# Altium project Fast_Servo.PrjPCB (part 6 of 7)

## Sheet PWR_P12V0A_N12V0A.SchDoc: Power +12.0 V/-12.0 V
size 420 x 297 mm; Author: P. Zdunek; DrawnBy: P. Zdunek; DocumentNumber: 26; SheetNumber: 26; SheetTotal: 37; ModifiedBy: -; CheckedDate: -; Title2: Fast Stabilizer; DivGrp: WUT ISE; Designer: G.Kasprowicz
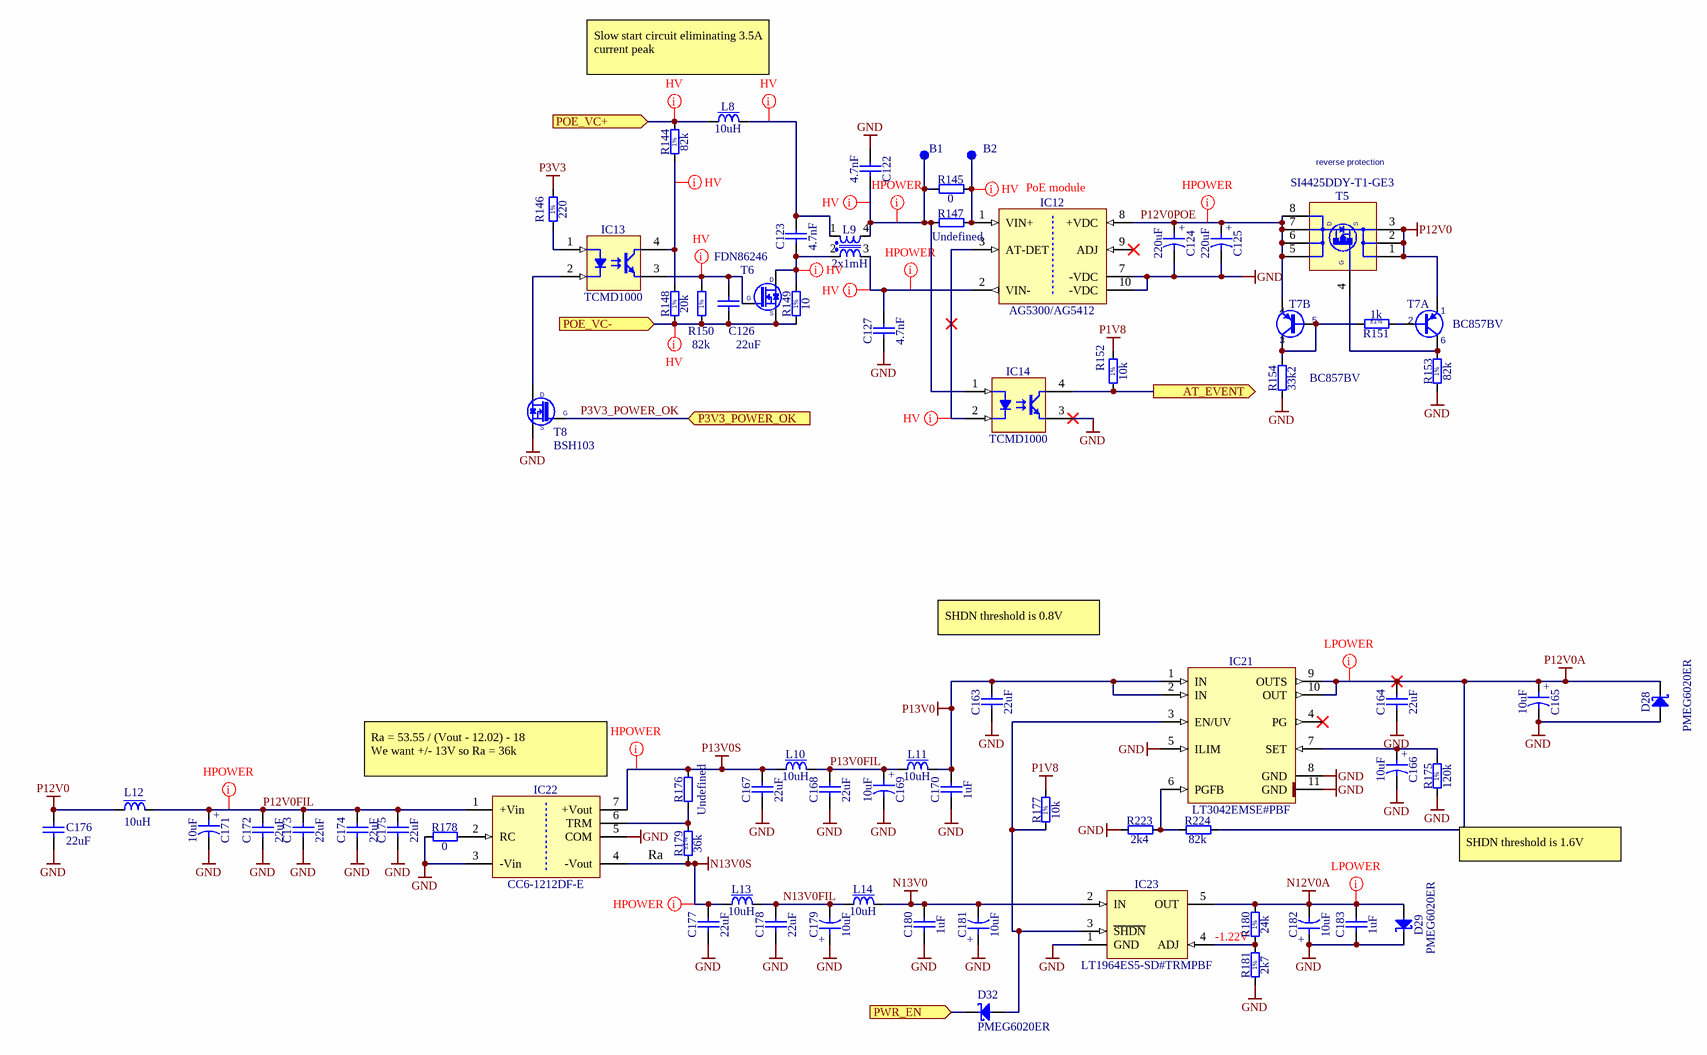
[diagram p21: PWR_P12V0A_N12V0A.SchDoc]

### Parts
B1  SMD Pad  [C100]  (value not drawn)  (no BOM)
B2  SMD Pad  [C100]  (value not drawn)  (no BOM)
C122  4.7nF  [CAPC3216X140N]
C123  4.7nF  [CAPC3216X140N]
C124  220uF  [CAPAE830X620N]
C125  220uF  [CAPAE830X620N]
C126  22uF  [CAPC2012X135N]
C127  4.7nF  [CAPC3216X140N]
C163  22uF  [CAPC2012X135N]
C164  22uF  [CAPC2012X135N]
C165  10uF  [CAPMP3216X180N]
C166  10uF  [CAPMP3216X180N]
C167  22uF  [CAPC2012X135N]
C168  22uF  [CAPC2012X135N]
C169  10uF  [CAPMP3216X180N]
C170  1uF  [CAPC1005X55N]
C171  10uF  [CAPMP3216X180N]
C172  22uF  [CAPC2012X135N]
C173  22uF  [CAPC2012X135N]
C174  22uF  [CAPC2012X135N]
C175  22uF  [CAPC2012X135N]
C176  22uF  [CAPC2012X135N]
C177  22uF  [CAPC2012X135N]
C178  22uF  [CAPC2012X135N]
C179  10uF  [CAPMP3216X180N]
C180  1uF  [CAPC1005X55N]
C181  10uF  [CAPMP3216X180N]
C182  10uF  [CAPMP3216X180N]
C183  1uF  [CAPC1005X55N]
D28  PMEG6020ER  [SODFL3517X110N]
D29  PMEG6020ER  [SODFL3517X110N]
D32  PMEG6020ER  [SODFL3517X110N]
IC12  AG5300/AG5412  [SILVERTEL_AG5300]
IC13  TCMD1000  [SOIC127P700X242-4N]
IC14  TCMD1000  [SOIC127P700X242-4N]
IC21  LT3042EMSE#PBF  [SOP50P490X110-11N-R168X198]
IC22  CC6-1212DF-E  [CC6-1212DF-E]
IC23  LT1964ES5-SD#TRMPBF  [SOT95P280X100-5N]
L8  10uH  [IND_MURATA-PS_8400]
L9  2x1mH  [IND_WURTH_WE-SL2]
L10  10uH  [IND_MURATA-PS_8400]
L11  10uH  [IND_MURATA-PS_8400]
L12  10uH  [IND_MURATA-PS_8400]
L13  10uH  [IND_MURATA-PS_8400]
L14  10uH  [IND_MURATA-PS_8400]
R144  82k  [RESC1608X55N]
R145  0  [RESC1005X40N]
R146  220  [RESC1608X55N]
R147  Undefined  [RESC1608X55N]
R148  20k  [RESC1005X40N]
R149  10  [RESC1005X40N]
R150  82k  [RESC1608X55N]
R151  1k  Tolerance: ±1%  [RESC1005X40N]
R152  10k  [RESC1005X40N]
R153  82k  [RESC1608X55N]
R154  33k2  [RESC1608X55N]
R175  120k  [RESC1608X55N]
R176  Undefined  [RESC1608X55N]
R177  10k  [RESC1005X40N]
R178  0  [RESC1005X40N]
R179  36k  Tolerance: ±1%  [RESC1005X40N]
R180  24k  [RESC1608X55N]
R181  2k7  [RESC1608X55N]
R223  2k4  [RESC1005X40N]
R224  82k  [RESC1608X55N]
T5  SI4425DDY-T1-GE3  [SOIC127P600X175-8N]
T6  FDN86246  [SOT95P237X112-3N]
T7  BC857BV  [SOTFL50P160X60-6N]  (parts A,B of 2)
T8  BSH103  [SOT95P230X110-3N]

### Ports
AT_EVENT (out), P3V3_POWER_OK (in), POE_VC+ (in), POE_VC- (in), PWR_EN (in)

### Nets
GND: C122.1 C124.2 C125.2 C127.1 C163.1 C164.1 C165.2 C166.2 C167.1 C168.1 C169.2 C170.1 C171.2 C172.1 C173.1 C174.1 C175.1 C176.1 C177.1 C178.1 C179.1 C180.1 C181.1 C182.1 C183.1 D28.2(A) D29.1(C) IC12.7(-VDC) IC12.10(-VDC) IC14.3(E) IC21.5(ILIM) IC21.8(GND) IC21.11(GND) IC22.3(-Vin) IC22.5(COM) IC23.1(GND) R153.1 R154.1 R175.1 R178.1 R181.1 R223.1 T8.2(S)
N12V0A: C182.2 C183.2 D29.2(A) IC23.5(OUT) R180.2
N13V0: C180.2 C181.2 IC23.2(IN) L14.2
N13V0S: C177.2 IC22.4(-Vout) L13.1 R179.1
P1V8: R152.2 R177.2
P3V3: R146.2
P12V0: C176.2 L12.1 T5.1(S) T5.2(S) T5.3(S) T7.1(E)
P12V0A: C164.2 C165.1 D28.1(C) IC21.9(OUTS) IC21.10(OUT) R224.2
P13V0: C163.2 C170.2 IC21.1(IN) IC21.2(IN) L11.2
P13V0S: C167.2 IC22.7(+Vout) L10.1 R176.2
AT_EVENT: IC14.4(C) R152.1 ; port AT_EVENT
N13V0FIL: C178.2 C179.2 L13.2 L14.1
P3V3_POWER_OK: T8.1(G) ; port P3V3_POWER_OK
P12V0FIL: C171.1 C172.2 C173.2 C174.2 C175.2 IC22.1(+Vin) L12.2
P12V0POE: C124.1 C125.1 IC12.8(+VDC) T5.5(D) T5.6(D) T5.7(D) T5.8(D) T7.4(E)
P13V0FIL: C168.2 C169.1 L10.2 L11.1
POE_VC+: L8.1 R144.2 ; port POE_VC+
POE_VC-: C126.1 R148.1 R149.1 R150.1 T6.2(S) ; port POE_VC-
PWR_EN: D32.1(C) ; port PWR_EN
NetB1_1: B1.1 C122.2 IC14.1(A) L9.4 R145.1 R147.1
NetB2_1: B2.1 IC12.1(VIN+) R145.2 R147.2
NetC123_1: C123.1 L9.2 R149.2 T6.3(D)
NetC123_2: C123.2 L8.2 L9.1
NetC126_2: C126.2 IC13.3(E) R150.2 T6.1(G)
NetC127_2: C127.2 IC12.2(VIN-) L9.3
NetC166_1: C166.1 IC21.7(SET) R175.2
NetD32_2: D32.2(A) IC21.3(EN/UV) IC23.3(~{SHDN}) R177.1
NetIC12_3: IC12.3(AT-DET) IC14.2(C)
NetIC13_1: IC13.1(A) R146.1
NetIC13_2: IC13.2(C) T8.3(D)
NetIC13_4: IC13.4(C) R144.1 R148.2
NetIC21_6: IC21.6(PGFB) R223.2 R224.1
NetIC22_2: IC22.2(RC) R178.2
NetIC22_6: IC22.6(TRM) R176.1 R179.2
NetIC23_4: IC23.4(ADJ) R180.1 R181.2
NetR151_1: R151.1 T7.2(B)
NetR151_2: R151.2 R154.2 T7.3(C) T7.5(B)
NetR153_2: R153.2 T5.4(S) T7.6(C)

Not connected (* = marked no-connect by the designer): IC12 9(ADJ)*; IC21 4(PG)*

### Layout directives
net class Hpower; rule Routing Via Style [Pref Size = 0.7mm    Pref Hole Size = 0.5mm]; rule Width Constraint [Pref Width = 20mil    Min Width = 15mil    Max Width = 50mil]: N13V0S, NetB1_1, NetC127_2, P12V0FIL, P12V0POE, P13V0S
net class Lpower: N12V0A, P12V0A
net class HV: NetB1_1, NetB2_1, NetC123_1, NetC123_2, NetC126_2, NetC127_2, NetIC12_3, NetIC13_4, POE_VC+, POE_VC-

### Notes on the sheet
- Slow start circuit eliminating 3.5A current peak
- (near IC12) PoE module
- (near T5) reverse protection
- SHDN threshold is 0.8V
- Ra = 53.55 / (Vout - 12.02) - 18
  We want +/- 13V so Ra = 36k
- (near R179) Ra
- (near R175) SHDN threshold is 1.6V
- -1.22V
- Project/Equipment
- Document
- Designer
- Drawn by
- Check.by
- Copyright WUT ISE 2020.
  This documentation describes Open Hardware and is licensed under the CERN OHL v.1.2. You may redistribute and modify this documentation under the terms of the CERN OHL v.1.2. (http://ohwr.org/CERNOHL). This documentation is distributed WITHOUT ANY EXPRESS OR IMPLIED WARRANTY, INCLUDING OF MERCHANTABILITY, SATISFACTORY QUALITY AND FITNESS FOR A PARTICULAR PURPOSE. Please see the CERN OHL v.1.2 for applicable conditions.
- Contact
- File
- Last Mod.
- Print Date
- Sheet
- Size
- A3
- of
- Rev
- (in symbol CAE830-620_220UF_16V_20%) +
- (in symbol CTE3216-18_10UF_16V_20%_AVX_TCJ) +
- (in symbol R0402_10K_1%_0.0625W_100PPM) 1%
- (in symbol R0402_10R_1%_0.0625W_200PPM) 1%
- (in symbol R0402_20K_1%_0.0625W_100PPM) 1%
- (in symbol R0603_2K7_1%_0.1W_100PPM) 1%
- (in symbol R0603_24K_1%_0.1W_100PPM) 1%
- (in symbol R0603_82K_1%_0.1W_100PPM) 1%
- (in symbol R0603_120k_1%_0.1W_100PPM) 1%
- (in symbol R0603_220R_1%_0.1W_100PPM) 1%
- (in symbol SI4425DDY-T1-GE3) G

### Library data of the parts
B1 B2 = SMD_PAD_D1MM: Through Hole Pad; Part Description: 1mm Diameter SMD Pad; Mounted: No; Part Number: SMD_PAD_D1MM; Component Type: Standard (No BOM); Pin Count: 1; Family: SMD Pad; Socket: No; SMD: No; Sense: No; Status: None; ComponentHeight: 0mm; HelpURL: Undefined; Author: CERN DEM JLC; CreateDate: 10.10.2017; LatestRevisionDate: 10.10.2017; PackageDescription: 1mm Diameter SMD Pad
C122 C123 C127 = CAP_SMD_1206_4.7n_500V: Non-polarised capacitor; Part Number: CC1206_4.7NF_500V_10%_X7R; Part Description: SMD Multilayer Chip Ceramic Capacitor; Manufacturer: GENERIC; Manufacturer1 Part Number: C1206C472KCRACTU; Voltage: 500V; TC: X7R; Tolerance: ±10%; Table: Capacitors SMD; Component Kind: Standard; Component Type: Standard; Pin Count: 2; Value: 4.7nF; Status: Preferred; Manufacturer Part Number: CC1206_4.7NF_500V_10%_X7R; Case: 1206; Mounted: Yes; Socket: No; SMD: Yes; Manufacturer1 Example: KEMET; Manufacturer1 ComponentHeight: 1.7mm; HelpURL: \\cern.ch\dfs\Applications\Altium\Datasheets\CC1206_X7R_VISHAY_VJ.pdf; Author: GK; CreateDate: 2007-12-03; LatestRevisionDate: 2007-12-03
C124 C125 = CAE830-620_220UF_16V_20%: Polarised capacitor; Part Description: Aluminum Electrolytic SMT Capacitor; Manufacturer: PANASONIC; Manufacturer Part Number: EEEFK1C221AP; Voltage: 16V; Tolerance: ±20%; Part Number: CAE830-620_220UF_16V_20%; Component Kind: Standard; Component Type: Standard; Pin Count: 2; Value: 220uF; Status: Not Recommended; Case: E; Mounted: Yes; Socket: No; SMD: Yes; Sense: No; ComponentHeight: 6.2mm; HelpURL: \\cern.ch\dfs\Applications\Altium\Datasheets\CAE_PANASONIC_FK.pdf; Author: CERN DEM JLC; CreateDate: 03.12.2007; LatestRevisionDate: 05.11.2014
C126 C163 C164 C167 C168 C172-C178 = CC0805_22UF_16V_10%_X5R: Non-polarised capacitor; Part Description: SMD Multilayer Chip Ceramic Capacitor; Manufacturer: GENERIC; Manufacturer1 Part Number: C2012X5R1C226KT; Voltage: 16V; TC: X5R; Tolerance: ±10%; Part Number: CC0805_22UF_16V_10%_X5R; Component Kind: Standard; Component Type: Standard; Pin Count: 2; Value: 22uF; Status: Preferred; Manufacturer Part Number: CC0805_22UF_16V_10%_X5R; Case: 0805; Mounted: Yes; Socket: No; SMD: Yes; Sense: No; Manufacturer1 Example: TDK; Manufacturer1 ComponentHeight: 1.35mm; HelpURL: \\cern.ch\dfs\Applications\Altium\Datasheets\CC0805_X5R_TDK_C.pdf; Author: CERN DEM JLC; CreateDate: 25.10.2012; LatestRevisionDate: 25.10.2012
C165 C166 C169 C171 C179 C181 C182 = CTE3216-18_10UF_16V_20%_AVX_TCJ: Polarised capacitor; Part Description: ESR 0R200 Tantalum Solid Electrolytic Chip Capacitor with Conductive Polymer Electrode; Manufacturer: AVX; Manufacturer Part Number: TCJA106M016R0200; Voltage: 16V; Tolerance: ±20%; Part Number: CTE3216-18_10UF_16V_20%_AVX_TCJ; Component Kind: Standard; Component Type: Standard; Pin Count: 2; Value: 10uF; Status: Preferred; Case: A; Mounted: Yes; Socket: No; SMD: Yes; Sense: No; ComponentHeight: 1.8mm; HelpURL: \\cern.ch\dfs\Applications\Altium\Datasheets\CTE_AVX_TCJ.pdf; Author: CERN DEM JLC; CreateDate: 29.03.2012; LatestRevisionDate: 29.03.2012
C170 C180 C183 = CC0402_1UF_16V_10%_X5R: Non-polarised capacitor; Part Description: SMD Multilayer Chip Ceramic Capacitor; Manufacturer: GENERIC; Manufacturer1 Part Number: C1005X5R1C105KT; Voltage: 16V; TC: X5R; Tolerance: ±10%; Part Number: CC0402_1UF_16V_10%_X5R; Component Kind: Standard; Component Type: Standard; Pin Count: 2; Value: 1uF; Status: Preferred; Manufacturer Part Number: CC0402_1UF_16V_10%_X5R; Case: 0402; Mounted: Yes; Socket: No; SMD: Yes; Sense: No; Manufacturer1 Example: TDK; Manufacturer1 ComponentHeight: 0.55mm; HelpURL: \\cern.ch\dfs\Applications\Altium\Datasheets\CC0402_X5R_TDK_C.pdf; Author: CERN DEM JLC; CreateDate: 25/10/2012; LatestRevisionDate: 25/10/2012
D28 D29 D32 = PMEG6020ER: Schottky Diode; Part Description: MEGA Schottky Barrier Rectifier; Manufacturer: NXP SEMICONDUCTORS; Voltage: 60V; Power: 2A; PressFit: No; Bonding: No; Part Number: PMEG6020ER; Component Kind: Standard; Component Type: Standard; Device: PMEG6020ER; PackageDescription: SODFL Diode (SOD123W); 2.60mm W X 1.70mm L X 1.10mm H body, IPC Medium Density; Manufacturer Part Number: PMEG6020ER; Pin Count: 2; Case: SOD-123FL; Mounted: Yes; Socket: No; SMD: Yes; Sense: No; ComponentHeight: 1.1mm; HelpURL: \\cern.ch\dfs\Applications\Altium\Datasheets\PMEG6020ER.pdf; Author: CERN DEM JMW; CreateDate: 19.06.2014; LatestRevisionDate: 19.06.2014
IC12 = AG5300: Power-over-Ethernet Plus (POE+) Module; Part Description: 12V 30W Power-over-Ethernet Plus (POE+); Manufacturer: SILVERTEL; PressFit: No; Bonding: No; Part Number: AG5300/AG5412; Component Kind: Standard; Component Type: Standard; Device: AG5300/AG5412; PackageDescription: Power-over-Ethernet Plus (POE+) Module, Body L 57.3mm x W 18mm x H 14mm; Manufacturer Part Number: AG5300/AG5412; Pin Count: 10; Mounted: Yes; Socket: No; SMD: No; Sense: No; ComponentHeight: 14mm; HelpURL: \\cern.ch\dfs\Applications\Altium\Datasheets\AG5300.pdf; Author: CERN DEM JLC; CreateDate: 20.03.2018; LatestRevisionDate: 20.03.2018
IC13 IC14 = TCMD1000: Single Optocoupler; Part Number: TCMD1000-217-500E; Part Description: DC Input, Half-Pitch Phototransistor Optocoupler; Manufacturer: VISHAY; PressFit: No; Bonding: No; Component Kind: Standard; Component Type: Standard; Device: TCMD1000; PackageDescription: SOIC, 1.27mm, pitch; 4 pin, 2.60mm W X 4.40mm L X 2.42mm H body, IPC Medium Density; Status: Not Recommended; Manufacturer Part Number: TCMD1000; Pin Count: 4; Case: SOIC4; Mounted: Yes; Socket: No; SMD: Yes; Sense: No; ComponentHeight: 2.42mm; HelpURL: \\cern.ch\dfs\Applications\Altium\Datasheets\ACPL-217-500E.pdf; Author: GK; CreateDate: 11.11.2014; LatestRevisionDate: 11.11.2014
IC21 = LT3042EMSE#PBF: 20V, 200mA, Ultralow Noise, Ultrahigh PSRR RF Linear Regulator; Manufacturer: LINEAR TECHNOLOGY; PressFit: No; Bonding: No; Part Number: LT3042EMSE#PBF; Component Kind: Standard; Component Type: Standard; Device: LT3042EMSE#PBF; PackageDescription: SOP, 0.50mm, Pitch; 10 pin, 3.00mm W X 3.00mm L X 1.10mm H body (w/thermal tab  1.68 X 1.98 mm), IPC Medium Density; Part Description: 20V, 200mA, Ultralow Noise, Ultrahigh PSRR RF Linear Regulator; Manufacturer Part Number: LT3042EMSE#PBF; Pin Count: 11; Case: MSOP10; Mounted: Yes; Socket: No; SMD: Yes; Sense: No; ComponentHeight: 1.1mm; HelpURL: \\cern.ch\dfs\Applications\Altium\Datasheets\LT3042EMSE#PBF.pdf; Author: CERN DEM MR; CreateDate: 09.06.2016; LatestRevisionDate: 09.06.2016
IC22 = DC/DC_CC6-1212DF-E: CONV DC/DC 6W DUAL 12V +-12V PCB; Manufacturer: TDK-Lambda Americas Inc.; PressFit: No; Bonding: No; Part Number: CC6-1212DF-E; Component Kind: Standard; Component Type: Standard; Device: CC6-1212DF-E; PackageDescription: CC6 Series, Body 0.900 x 0.831 x 0.335, Regulated; Part Description: CONV DC/DC 6W DUAL 12V +-12V PCB; Manufacturer Part Number: CC6-1212DF-E; Pin Count: 7; Mounted: Yes; Socket: No; SMD: No; Sense: No; ComponentHeight: 10.45mm; Author: GK; CreateDate: 17.12.2016; LatestRevisionDate: 17.12.2016
IC23 = LT1964ES5-SD#TRMPBF: 200mA, Low Noise, Low Dropout Negative Micropower Regulator; Part Description: -1.22V to -20V, 200mA, Low Noise, Low Dropout Negative Micropower Regulator; Manufacturer: LINEAR TECHNOLOGY; PressFit: No; Bonding: No; Part Number: LT1964ES5-SD#TRMPBF; Component Kind: Standard; Component Type: Standard; Device: LT1964ES5-SD#TRMPBF; PackageDescription: SOT23, 0.95mm pitch; 5 pin, 1.75mm W X 3.00mm L, IPC Medium Density; Manufacturer Part Number: LT1964ES5-SD#TRMPBF; Pin Count: 5; Case: SOT23-5; Mounted: Yes; Socket: No; SMD: Yes; Sense: No; ComponentHeight: 1mm; HelpURL: \\cern.ch\dfs\Applications\Altium\Datasheets\LT1964ES5-SD#TRMPBF.pdf; Author: CERN DEM JLC; CreateDate: 05.05.2009; LatestRevisionDate: 05.05.2009
L8 L10-L14 = IND_10UH_10%_MURATA-PS_8400: Inductor With Core; Part Description: Miniature Surface Mount Power Inductor (8400 Serie); Manufacturer: MURATA POWER SOLUTIONS; Manufacturer Part Number: 84103C; Power: 950mA; Resistance: 0.24R; Tolerance: ±10%; Part Number: IND_10UH_10%_MURATA-PS_8400; Component Kind: Standard; Component Type: Standard; Pin Count: 2; Value: 10uH; Status: None; Mounted: Yes; Socket: No; SMD: Yes; Sense: No; ComponentHeight: 2.9mm; HelpURL: \\cern.ch\dfs\Applications\Altium\Datasheets\IND_MURATA-PS_8400.pdf; Author: CERN DEM JLC; CreateDate: 02.07.2012; LatestRevisionDate: 02.07.2012
L9 = IND_1MH_50%_WURTH_WE-SL2-744222: Inductor Common Mode; Part Description: Common Mode SMD Line Filter (WE-SL2 Series); Manufacturer: WURTH ELEKTRONIK; Manufacturer Part Number: 744222; Power: 800mA; Resistance: 0.31R; Tolerance: ±50%; Part Number: IND_1MH_50%_WURTH_WE-SL2-744222; Component Kind: Standard; Component Type: Standard; Pin Count: 4; Value: 2x1mH; Status: None; Mounted: Yes; Socket: No; SMD: Yes; Sense: No; ComponentHeight: 5.3mm; HelpURL: \\cern.ch\dfs\Applications\Altium\Datasheets\IND_WURTH_WE-SL2_744222.pdf; Author: CERN DEM JLC; CreateDate: 04.06.2012; LatestRevisionDate: 15.10.2012
R144 R150 R153 = R0603_82K_1%_0.1W_100PPM: Resistor - 1%; Part Description: General Purpose Thick Film Chip Resistor; Manufacturer: GENERIC; Manufacturer1 Part Number: NRC06F8202TRF; Power: 0.1W; TC: ±100ppm/°C; Part Number: R0603_82K_1%_0.1W_100PPM; Component Kind: Standard; Component Type: Standard; Pin Count: 2; Value: 82k; Status: Preferred; Tolerance: ±1%; Manufacturer Part Number: R0603_82K_1%_0.1W_100PPM; Case: 0603; Mounted: Yes; Sense: No; Socket: No; SMD: Yes; Manufacturer1 Example: NIC COMPONENT; Manufacturer1 ComponentHeight: 0.55mm; HelpURL: \\cern.ch\dfs\Applications\Altium\Datasheets\R0603_NIC_NRC.pdf; Author: CERN DEM JLC; CreateDate: 03.12.2007; LatestRevisionDate: 13.03.2008
R145 R178 = R0402_0R_JUMPER: Resistor; Part Description: 1A (0.05R Max DC Resistance) Zero Ohm Jumper; Manufacturer: GENERIC; Manufacturer1 Part Number: 232270591001L; Part Number: R0402_0R_JUMPER; Component Kind: Standard; Component Type: Standard; Pin Count: 2; Value: 0; Status: Not recommended; Manufacturer Part Number: R0402_0R_JUMPER; Case: 0402; Mounted: Yes; Sense: No; Socket: No; SMD: Yes; Manufacturer1 Example: YAGEO PHYCOMP; Manufacturer1 ComponentHeight: 0.4mm; HelpURL: \\cern.ch\dfs\Applications\Altium\Datasheets\R0402_Phycomp_RC0402.pdf; Author: CERN DEM JLC; CreateDate: 03.12.2007; LatestRevisionDate: 17.10.2012
R146 = R0603_220R_1%_0.1W_100PPM: Resistor - 1%; Part Description: General Purpose Thick Film Chip Resistor; Manufacturer: GENERIC; Manufacturer1 Part Number: NRC06F2200TRF; Power: 0.1W; TC: ±100ppm/°C; Part Number: R0603_220R_1%_0.1W_100PPM; Component Kind: Standard; Component Type: Standard; Pin Count: 2; Value: 220; Status: Preferred; Tolerance: ±1%; Manufacturer Part Number: R0603_220R_1%_0.1W_100PPM; Case: 0603; Mounted: Yes; Sense: No; Socket: No; SMD: Yes; Manufacturer1 Example: NIC COMPONENT; Manufacturer1 ComponentHeight: 0.55mm; HelpURL: \\cern.ch\dfs\Applications\Altium\Datasheets\R0603_NIC_NRC.pdf; Author: CERN DEM JLC; CreateDate: 03.12.2007; LatestRevisionDate: 13.03.2008
R147 = R0603_NO-VALUE: Resistor; Part Description: Reserved Footprint For a 0603 (1608) Chip Resistor; PressFit: No; Mounted: No; Part Number: R0603_NO-VALUE; Component Kind: Standard; Component Type: Standard; Pin Count: 2; Value: Undefined; Status: None; Manufacturer: Undefined; Manufacturer Part Number: R0603_NO-VALUE; Case: 0603; Sense: No; Socket: No; SMD: Yes; Manufacturer1 Example: Undefined; Manufacturer1 Part Number: Undefined; Manufacturer1 ComponentHeight: Undefined; HelpURL: Undefined; Author: CERN DEM JLC; CreateDate: 03.12.2007; LatestRevisionDate: 13.03.2008
R148 = R0402_20K_1%_0.0625W_100PPM: Resistor - 1%; Part Description: General Purpose Thick Film Chip Resistor; Manufacturer: GENERIC; Manufacturer1 Part Number: 232270672003L; TC: ±100ppm/°C; PressFit: No; Part Number: R0402_20K_1%_0.0625W_100PPM; Component Kind: Standard; Component Type: Standard; Pin Count: 2; Value: 20k; Status: Not Recommended; Power: 0.0625W; Tolerance: ±1%; Manufacturer Part Number: R0402_20K_1%_0.0625W_100PPM; Case: 0402; Mounted: Yes; Sense: No; Socket: No; SMD: Yes; Manufacturer1 Example: YAGEO PHYCOMP; Manufacturer1 ComponentHeight: 0.4mm; HelpURL: \\cern.ch\dfs\Applications\Altium\Datasheets\R0402_Phycomp_RC0402.pdf; Author: CERN DEM JLC; CreateDate: 03.12.2007; LatestRevisionDate: 17.10.2012
R149 = R0402_10R_1%_0.0625W_200PPM: Resistor - 1%; Part Description: General Purpose Thick Film Chip Resistor; Manufacturer: GENERIC; Manufacturer1 Part Number: 232270671009L; TC: ±200ppm/°C; PressFit: No; Part Number: R0402_10R_1%_0.0625W_200PPM; Component Kind: Standard; Component Type: Standard; Pin Count: 2; Value: 10; Status: Not Recommended; Power: 0.0625W; Tolerance: ±1%; Manufacturer Part Number: R0402_10R_1%_0.0625W_200PPM; Case: 0402; Mounted: Yes; Sense: No; Socket: No; SMD: Yes; Manufacturer1 Example: YAGEO PHYCOMP; Manufacturer1 ComponentHeight: 0.4mm; HelpURL: \\cern.ch\dfs\Applications\Altium\Datasheets\R0402_Phycomp_RC0402.pdf; Author: CERN DEM JLC; CreateDate: 24/06/2009; LatestRevisionDate: 17/10/2012
R151 = R0402_1K_1%_0.0625W_100PPM: Resistor - 1%; Part Description: General Purpose Thick Film Chip Resistor; Manufacturer: GENERIC; Manufacturer1 Part Number: 232270671002L; TC: ±100ppm/°C; PressFit: No; Part Number: R0402_1K_1%_0.0625W_100PPM; Component Kind: Standard; Component Type: Standard; Pin Count: 2; Value: 1k; Status: Not Recommended; Power: 0.0625W; Manufacturer Part Number: R0402_1K_1%_0.0625W_100PPM; Case: 0402; Mounted: Yes; Sense: No; Socket: No; SMD: Yes; Manufacturer1 Example: YAGEO PHYCOMP; Manufacturer1 ComponentHeight: 0.4mm; HelpURL: \\cern.ch\dfs\Applications\Altium\Datasheets\R0402_Phycomp_RC0402.pdf; Author: CERN DEM JLC; CreateDate: 03.12.2007; LatestRevisionDate: 17.10.2012
R152 R177 = R0402_10K_1%_0.0625W_100PPM: Resistor - 1%; Part Description: General Purpose Thick Film Chip Resistor; Manufacturer: GENERIC; Manufacturer1 Part Number: 232270671003L; TC: ±100ppm/°C; PressFit: No; Part Number: R0402_10K_1%_0.0625W_100PPM; Component Kind: Standard; Component Type: Standard; Pin Count: 2; Value: 10k; Status: Not Recommended; Power: 0.0625W; Tolerance: ±1%; Manufacturer Part Number: R0402_10K_1%_0.0625W_100PPM; Case: 0402; Mounted: Yes; Sense: No; Socket: No; SMD: Yes; Manufacturer1 Example: YAGEO PHYCOMP; Manufacturer1 ComponentHeight: 0.4mm; HelpURL: \\cern.ch\dfs\Applications\Altium\Datasheets\R0402_Phycomp_RC0402.pdf; Author: CERN DEM JLC
  R152: CreateDate: 03.12.2007; LatestRevisionDate: 17.10.2012
  R177: CreateDate: 03/12/2007; LatestRevisionDate: 17/10/2012
R154 = R0603_33K2_0.1%_0.063W_10PPM: Resistor - 0.1%; Part Description: Thin Film Chip Resistor; Manufacturer: GENERIC; Manufacturer1 Part Number: RN73C1J33K2BTDF; Power: 0.063W; TC: ±10ppm; PressFit: No; Part Number: R0603_33K2_0.1%_0.063W_10PPM; Component Kind: Standard; Component Type: Standard; Pin Count: 2; Value: 33k2; Status: Not Recommended; Tolerance: ±0.1%; Manufacturer Part Number: R0603_33K2_0.1%_0.063W_10PPM; Case: 0603; Mounted: Yes; Sense: No; Socket: No; SMD: Yes; Manufacturer1 Example: TYCO HOLSWORTHY; Manufacturer1 ComponentHeight: 0.5mm; HelpURL: \\cern.ch\dfs\Applications\Altium\Datasheets\R0603_Tyco_RN73.pdf; Author: CERN DEM JLC; CreateDate: 03.12.2007; LatestRevisionDate: 13.03.2008
R175 = R0603_120k_1%_0.1W_100PPM: Resistor - 1%; Part Description: General Purpose Thick Film Chip Resistor; Manufacturer: GENERIC; Manufacturer1 Part Number: NRC06F1203TRF; Power: 0.1W; TC: ±100ppm/°C; PressFit: No; Part Number: R0603_120K_1%_0.1W_100PPM; Component Kind: Standard; Component Type: Standard; Pin Count: 2; Value: 120k; Status: Preferred; Tolerance: ±1%; Manufacturer Part Number: R0603_120K_1%_0.1W_100PPM; Case: 0603; Mounted: Yes; Sense: No; Socket: No; SMD: Yes; Manufacturer1 Example: NIC COMPONENT; Manufacturer1 ComponentHeight: 0.55mm; HelpURL: \\cern.ch\dfs\Applications\Altium\Datasheets\R0603_NIC_NRC.pdf; Author: CERN DEM JLC; CreateDate: 03.12.2007; LatestRevisionDate: 13.03.2008
R176 = R0603_NO-VALUE: Resistor; Part Description: Reserved Footprint For a 0603 (1608) Chip Resistor; Mounted: No; Part Number: R0603_NO-VALUE; Component Kind: Standard; Component Type: Standard; Pin Count: 2; Value: Undefined; Status: None; Manufacturer: Undefined; Manufacturer Part Number: R0603_NO-VALUE; Case: 0603; Sense: No; Socket: No; SMD: Yes; Manufacturer1 Example: Undefined; Manufacturer1 Part Number: Undefined; Manufacturer1 ComponentHeight: Undefined; HelpURL: Undefined; Author: CERN DEM JLC; CreateDate: 03.12.2007; LatestRevisionDate: 13.03.2008
R179 = R0402_36K_1%_0.0625W_100PPM: Resistor - 1%; Part Description: General Purpose Thick Film Chip Resistor; Manufacturer: GENERIC; Manufacturer1 Part Number: 232270673603L; TC: ±100ppm/°C; PressFit: No; Part Number: R0402_36K_1%_0.0625W_100PPM; Component Kind: Standard; Component Type: Standard; Pin Count: 2; Value: 36k; Status: Not Recommended; Power: 0.0625W; Manufacturer Part Number: R0402_36K_1%_0.0625W_100PPM; Case: 0402; Mounted: Yes; Sense: No; Socket: No; SMD: Yes; Manufacturer1 Example: YAGEO PHYCOMP; Manufacturer1 ComponentHeight: 0.4mm; HelpURL: \\cern.ch\dfs\Applications\Altium\Datasheets\R0402_Phycomp_RC0402.pdf; Author: CERN DEM JLC; CreateDate: 03.12.2007; LatestRevisionDate: 17.10.2012
R180 = R0603_24K_1%_0.1W_100PPM: Resistor - 1%; Part Description: General Purpose Thick Film Chip Resistor; Manufacturer: GENERIC; Manufacturer1 Part Number: NRC06F2402TRF; Power: 0.1W; TC: ±100ppm/°C; Part Number: R0603_24K_1%_0.1W_100PPM; Component Kind: Standard; Component Type: Standard; Pin Count: 2; Value: 24k; Status: Preferred; Tolerance: ±1%; Manufacturer Part Number: R0603_24K_1%_0.1W_100PPM; Case: 0603; Mounted: Yes; Sense: No; Socket: No; SMD: Yes; Manufacturer1 Example: NIC COMPONENT; Manufacturer1 ComponentHeight: 0.55mm; HelpURL: \\cern.ch\dfs\Applications\Altium\Datasheets\R0603_NIC_NRC.pdf; Author: CERN DEM JLC; CreateDate: 03.12.2007; LatestRevisionDate: 13.03.2008
R181 = R0603_2K7_1%_0.1W_100PPM: Resistor - 1%; Part Description: General Purpose Thick Film Chip Resistor; Manufacturer: GENERIC; Manufacturer1 Part Number: RC0603FR-072K7L; Power: 0.1W; TC: ±100ppm/°C; Part Number: R0603_2K7_1%_0.1W_100PPM; Component Kind: Standard; Component Type: Standard; Pin Count: 2; Value: 2k7; Status: Preferred; Tolerance: ±1%; Manufacturer Part Number: R0603_2K7_1%_0.1W_100PPM; Case: 0603; Mounted: Yes; Sense: No; Socket: No; SMD: Yes; Manufacturer1 Example: YAGEO PHYCOMP; Manufacturer1 ComponentHeight: 0.55mm; HelpURL: \\cern.ch\dfs\Applications\Altium\Datasheets\R0603_PHYCOMP_RC0603.pdf; Author: CERN DEM JLC; CreateDate: 02.05.2011; LatestRevisionDate: 02.05.2011
R223 = R0402_2K4_1%_0.0625W_100PPM: Resistor - 1%; Part Description: General Purpose Thick Film Chip Resistor; Manufacturer: GENERIC; Manufacturer1 Part Number: 232270672402L; TC: ±100ppm/°C; PressFit: No; Part Number: R0402_2K4_1%_0.0625W_100PPM; Component Kind: Standard; Component Type: Standard; Pin Count: 2; Value: 2k4; Status: Not Recommended; Power: 0.0625W; Tolerance: ±1%; Manufacturer Part Number: R0402_2K4_1%_0.0625W_100PPM; Case: 0402; Mounted: Yes; Sense: No; Socket: No; SMD: Yes; Manufacturer1 Example: YAGEO PHYCOMP; Manufacturer1 ComponentHeight: 0.4mm; HelpURL: \\cern.ch\dfs\Applications\Altium\Datasheets\R0402_Phycomp_RC0402.pdf; Author: CERN DEM JLC; CreateDate: 03.12.2007; LatestRevisionDate: 17.10.2012
R224 = R0603_82K_1%_0.1W_100PPM: Resistor - 1%; Part Description: General Purpose Thick Film Chip Resistor; Manufacturer: GENERIC; Manufacturer1 Part Number: NRC06F8202TRF; Power: 0.1W; TC: ±100ppm/°C; PressFit: No; Part Number: R0603_82K_1%_0.1W_100PPM; Component Kind: Standard; Component Type: Standard; Pin Count: 2; Value: 82k; Status: Preferred; Tolerance: ±1%; Manufacturer Part Number: R0603_82K_1%_0.1W_100PPM; Case: 0603; Mounted: Yes; Sense: No; Socket: No; SMD: Yes; Manufacturer1 Example: NIC COMPONENT; Manufacturer1 ComponentHeight: 0.55mm; HelpURL: \\cern.ch\dfs\Applications\Altium\Datasheets\R0603_NIC_NRC.pdf; Author: CERN DEM JLC; CreateDate: 03.12.2007; LatestRevisionDate: 13.03.2008
T5 = SI4425DDY-T1-GE3: -30V -19.7A P-Channel MOSFET; Manufacturer: VISHAY SILICONIX; PressFit: No; Bonding: No; Part Number: SI4425DDY-T1-GE3; Component Kind: Standard; Component Type: Standard; Device: SI4425DDY-T1-GE3; PackageDescription: SOIC 8, Pitch 1.27mm - Body 4x5mm, IPC Medium Density; Part Description: -30V -19.7A P-Channel MOSFET; Manufacturer Part Number: SI4425DDY-T1-GE3; Pin Count: 8; Case: SOIC8; Mounted: Yes; Socket: No; SMD: Yes; Sense: No; ComponentHeight: 1.75mm; HelpURL: \\cern.ch\dfs\Applications\Altium\Datasheets\SI4425DDY-T1-GE3.pdf; Author: CERN DEM MR; CreateDate: 05/10/2016; LatestRevisionDate: 05/10/2016
T6 = FDN86246: N-CHANNEL MOSFET WITH DIODE; Part Description: 150V 1.6A N-Channel Power Trench® MOSFET; Manufacturer: ON SEMICONDUCTOR; PressFit: No; Bonding: No; Part Number: FDN86246; Component Kind: Standard; Component Type: Standard; Device: FDN86246; PackageDescription: SOT, 0.95mm, pitch; 3 pin,1.30mm W X 2.92mm L X 1.12mm H body, IPC Medium Density; Manufacturer Part Number: FDN86246; Pin Count: 3; Case: SOT23-3; Mounted: Yes; Socket: No; SMD: Yes; Sense: No; ComponentHeight: 1.12mm; HelpURL: \\cern.ch\dfs\Applications\Altium\Datasheets\FDN86246.pdf; ComponentLink1URL: \\cern.ch\dfs\Applications\Altium\Datasheets\FDN86246_Package.pdf; ComponentLink1Description: Package Drawing; Author: CERN DEM BC; CreateDate: 10.10.2019; LatestRevisionDate: 10.10.2019
T7 = BC857BV: 45V, 100mA PNP General Purpose Double Transistor; Part Description: -45V -100mA PNP General Purpose Double Transistor; Manufacturer: NXP SEMICONDUCTORS; PressFit: No; Bonding: No; Part Number: BC857BV; Component Kind: Standard; Component Type: Standard; Device: BC857BV; PackageDescription: SOTFL (SOT666), 0.50mm, Pitch; 6 Pin, 1.20mm W X 1.60mm L X 0.60mm H Body, IPC Medium Density; Manufacturer Part Number: BC857BV; Pin Count: 6; Case: SOT666; Mounted: Yes; Socket: No; SMD: Yes; Sense: No; ComponentHeight: 0.6mm; HelpURL: \\cern.ch\dfs\Applications\Altium\Datasheets\BC857BV.pdf; Author: CERN DEM JLC; CreateDate: 01/12/2011; LatestRevisionDate: 01/12/2011
T8 = BSH103: N-CHANNEL MOSFET WITH DIODE; Part Description: 30V 850mA N-Channel Enhancement Mode Field-Effect Transistor; Manufacturer: NEXPERIA; PressFit: No; Bonding: No; Part Number: BSH103; Component Kind: Standard; Component Type: Standard; Device: BSH103; PackageDescription: SOT23, 0.95mm Pitch; 3 Pin, 1.30mm W X 2.90mm L X 1.10mm H body, IPC Medium Density; Manufacturer Part Number: BSH103; Pin Count: 3; Case: SOT23-3; Mounted: Yes; Socket: No; SMD: Yes; Sense: No; ComponentHeight: 1.1mm; HelpURL: \\cern.ch\dfs\Applications\Altium\Datasheets\BSH103.pdf; Author: CERN DEM JLC; CreateDate: 16.03.2010; LatestRevisionDate: 20.06.2017

## Sheet PWR_LDOs.SchDoc: Power LDOs
size 420 x 297 mm; Author: P. Zdunek; DrawnBy: P. Zdunek; DocumentNumber: 31; SheetNumber: 31; SheetTotal: 37; ModifiedBy: -; CheckedDate: -; Title2: Fast Stabilizer; DivGrp: WUT ISE; Designer: G.Kasprowicz
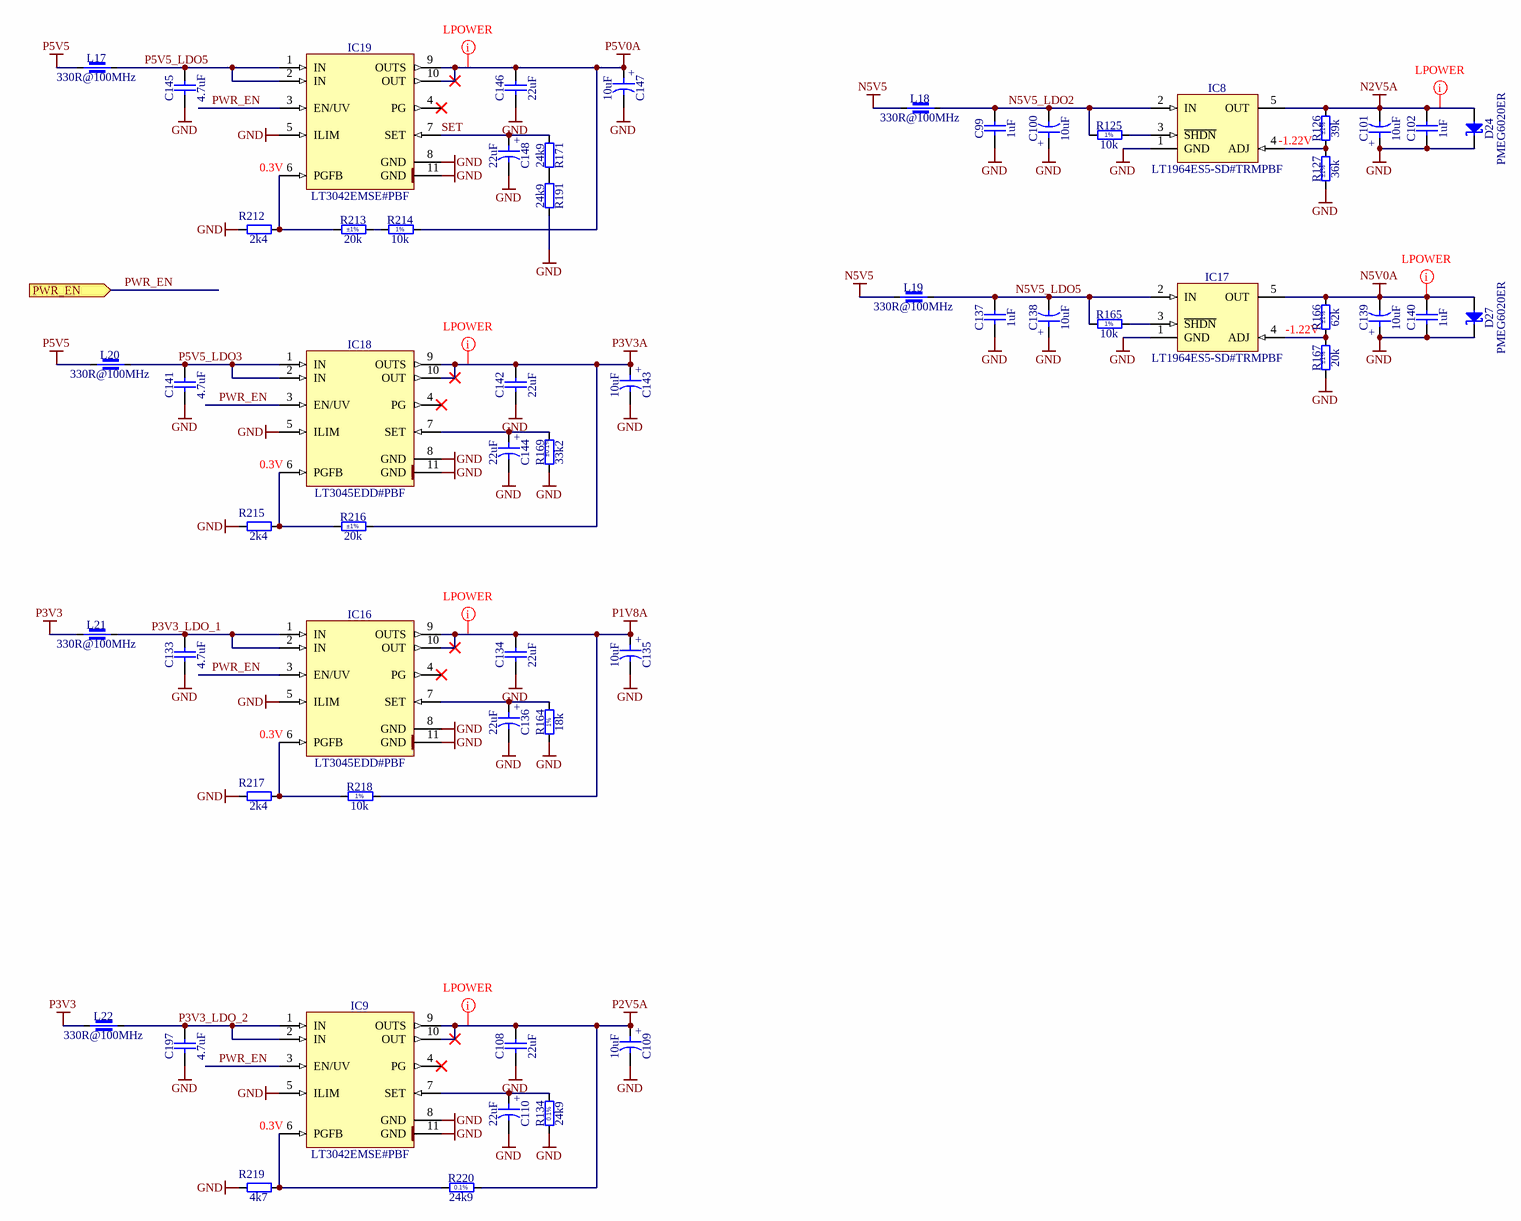
[diagram p22: PWR_LDOs.SchDoc]

### Parts
C99  1uF  [CAPC1005X55N]
C100  10uF  [CAPMP3216X180N]
C101  10uF  [CAPMP3216X180N]
C102  1uF  [CAPC1005X55N]
C108  22uF  [CAPC2012X135N]
C109  10uF  [CAPMP3216X180N]
C110  22uF  [CAPMP3216X180N]
C133  4.7uF  [CAPC1709X95N]
C134  22uF  [CAPC2012X135N]
C135  10uF  [CAPMP3216X180N]
C136  22uF  [CAPMP3216X180N]
C137  1uF  [CAPC1005X55N]
C138  10uF  [CAPMP3216X180N]
C139  10uF  [CAPMP3216X180N]
C140  1uF  [CAPC1005X55N]
C141  4.7uF  [CAPC1709X95N]
C142  22uF  [CAPC2012X135N]
C143  10uF  [CAPMP3216X180N]
C144  22uF  [CAPMP3216X180N]
C145  4.7uF  [CAPC1709X95N]
C146  22uF  [CAPC2012X135N]
C147  10uF  [CAPMP3216X180N]
C148  22uF  [CAPMP3216X180N]
C197  4.7uF  [CAPC1709X95N]
D24  PMEG6020ER  [SODFL3517X110N]
D27  PMEG6020ER  [SODFL3517X110N]
IC8  LT1964ES5-SD#TRMPBF  [SOT95P280X100-5N]
IC9  LT3042EMSE#PBF  [SOP50P490X110-11N-R168X198]
IC16  LT3045EDD#PBF  [SON50P300X300X80-11N-R175X248]
IC17  LT1964ES5-SD#TRMPBF  [SOT95P280X100-5N]
IC18  LT3045EDD#PBF  [SON50P300X300X80-11N-R175X248]
IC19  LT3042EMSE#PBF  [SOP50P490X110-11N-R168X198]
L17  330R@100MHz  [INDC1608X75N]
L18  330R@100MHz  [INDC1608X75N]
L19  330R@100MHz  [INDC1608X75N]
L20  330R@100MHz  [INDC1608X75N]
L21  330R@100MHz  [INDC1608X75N]
L22  330R@100MHz  [INDC1608X75N]
R125  10k  [RESC1005X40N]
R126  39k  Tolerance: ±1%  [RESC1005X40N]
R127  36k  Tolerance: ±1%  [RESC1005X40N]
R134  24k9  [RESC1608X55N]
R164  18k  [RESC1608X55N]
R165  10k  [RESC1005X40N]
R166  62k  Tolerance: ±1%  [RESC1005X40N]
R167  20k  Tolerance: ±1%  [RESC1005X40N]
R169  33k2  Tolerance: ±0.1%  [RESC1608X55N]
R171  24k9  [RESC1608X55N]
R191  24k9  [RESC1608X55N]
R212  2k4  [RESC1005X40N]
R213  20k  Tolerance: ±1%  [RESC1005X40N]
R214  10k  [RESC1005X40N]
R215  2k4  [RESC1005X40N]
R216  20k  Tolerance: ±1%  [RESC1005X40N]
R217  2k4  [RESC1005X40N]
R218  10k  [RESC1005X40N]
R219  4k7  [RESC1005X40N]
R220  24k9  [RESC1608X55N]

### Ports
PWR_EN (in)

### Nets
GND: C99.1 C100.1 C101.1 C102.1 C108.1 C109.2 C110.2 C133.1 C134.1 C135.2 C136.2 C137.1 C138.1 C139.1 C140.1 C141.1 C142.1 C143.2 C144.2 C145.1 C146.1 C147.2 C148.2 C197.1 D24.1(C) D27.1(C) IC8.1(GND) IC9.5(ILIM) IC9.8(GND) IC9.11(GND) IC16.5(ILIM) IC16.8(GND) IC16.11(GND) IC17.1(GND) IC18.5(ILIM) IC18.8(GND) IC18.11(GND) IC19.5(ILIM) IC19.8(GND) IC19.11(GND) R127.1 R134.1 R164.1 R167.1 R169.1 R191.2 R212.1 R215.1 R217.1 R219.1
N2V5A: C101.2 C102.2 D24.2(A) IC8.5(OUT) R126.2
N5V0A: C139.2 C140.2 D27.2(A) IC17.5(OUT) R166.2
N5V5: L18.1 L19.1
P1V8A: C134.2 C135.1 IC16.9(OUTS) IC16.10(OUT) R218.2
P2V5A: C108.2 C109.1 IC9.9(OUTS) IC9.10(OUT) R220.2
P3V3: L21.1 L22.1
P3V3A: C142.2 C143.1 IC18.9(OUTS) IC18.10(OUT) R216.2
P5V0A: C146.2 C147.1 IC19.9(OUTS) IC19.10(OUT) R214.2
P5V5: L17.1 L20.1
N5V5_LDO2: C99.2 C100.2 IC8.2(IN) L18.2 R125.1
N5V5_LDO5: C137.2 C138.2 IC17.2(IN) L19.2 R165.1
P3V3_LDO_1: C133.2 IC16.1(IN) IC16.2(IN) L21.2
P3V3_LDO_2: C197.2 IC9.1(IN) IC9.2(IN) L22.2
P5V5_LDO3: C141.2 IC18.1(IN) IC18.2(IN) L20.2
P5V5_LDO5: C145.2 IC19.1(IN) IC19.2(IN) L17.2
PWR_EN: IC9.3(EN/UV) IC16.3(EN/UV) IC18.3(EN/UV) IC19.3(EN/UV) ; port PWR_EN
SET: C148.1 IC19.7(SET) R171.1
NetC110_1: C110.1 IC9.7(SET) R134.2
NetC136_1: C136.1 IC16.7(SET) R164.2
NetC144_1: C144.1 IC18.7(SET) R169.2
NetIC8_3: IC8.3(~{SHDN}) R125.2
NetIC8_4: IC8.4(ADJ) R126.1 R127.2
NetIC9_6: IC9.6(PGFB) R219.2 R220.1
NetIC16_6: IC16.6(PGFB) R217.2 R218.1
NetIC17_3: IC17.3(~{SHDN}) R165.2
NetIC17_4: IC17.4(ADJ) R166.1 R167.2
NetIC18_6: IC18.6(PGFB) R215.2 R216.1
NetIC19_6: IC19.6(PGFB) R212.2 R213.1
NetR171_2: R171.2 R191.1
NetR213_2: R213.2 R214.1

Not connected (* = marked no-connect by the designer): IC9 4(PG)*; IC16 4(PG)*; IC18 4(PG)*; IC19 4(PG)*

### Layout directives
net class Lpower: N2V5A, N5V0A, P1V8A, P2V5A, P3V3A, P5V0A

### Notes on the sheet
- -1.22V
- (near IC19) 0.3V
- (near IC18) 0.3V
- (near IC16) 0.3V
- (near IC9) 0.3V
- Project/Equipment
- Document
- Designer
- Drawn by
- Check.by
- Copyright WUT ISE 2020.
  This documentation describes Open Hardware and is licensed under the CERN OHL v.1.2. You may redistribute and modify this documentation under the terms of the CERN OHL v.1.2. (http://ohwr.org/CERNOHL). This documentation is distributed WITHOUT ANY EXPRESS OR IMPLIED WARRANTY, INCLUDING OF MERCHANTABILITY, SATISFACTORY QUALITY AND FITNESS FOR A PARTICULAR PURPOSE. Please see the CERN OHL v.1.2 for applicable conditions.
- Contact
- File
- Last Mod.
- Print Date
- Sheet
- Size
- A3
- of
- Rev
- (in symbol CTE3216-18_10UF_16V_20%_AVX_TCJ) +
- (in symbol CTE3216-18_22UF_10V_10%) +
- (in symbol R0402_10K_1%_0.0625W_100PPM) 1%
- (in symbol R0603_18K_1%_0.1W_100PPM) 1%
- (in symbol R0603_24K9_0.1%_0.063W_10PPM) 0.1%

### Library data of the parts
C99 C102 C137 C140 = CC0402_1UF_16V_10%_X5R: as C170 on sheet PWR_P12V0A_N12V0A; Part Number: CC0402_1UF_16V_10%_X5R; Component Kind: Standard; Component Type: Standard; Pin Count: 2; Value: 1uF; Status: Preferred; Manufacturer Part Number: CC0402_1UF_16V_10%_X5R; Case: 0402; Mounted: Yes; Socket: No; SMD: Yes; Sense: No; Manufacturer1 Example: TDK; Manufacturer1 ComponentHeight: 0.55mm; HelpURL: \\cern.ch\dfs\Applications\Altium\Datasheets\CC0402_X5R_TDK_C.pdf; Author: CERN DEM JLC; CreateDate: 25/10/2012; LatestRevisionDate: 25/10/2012
C100 C101 C109 C135 C138 C139 C143 C147 = CTE3216-18_10UF_16V_20%_AVX_TCJ: as C165 on sheet PWR_P12V0A_N12V0A; Part Number: CTE3216-18_10UF_16V_20%_AVX_TCJ; Component Kind: Standard; Component Type: Standard; Pin Count: 2; Value: 10uF; Status: Preferred; Case: A; Mounted: Yes; Socket: No; SMD: Yes; Sense: No; ComponentHeight: 1.8mm; HelpURL: \\cern.ch\dfs\Applications\Altium\Datasheets\CTE_AVX_TCJ.pdf; Author: CERN DEM JLC; CreateDate: 29.03.2012; LatestRevisionDate: 29.03.2012
C108 C134 C142 C146 = CC0805_22UF_16V_10%_X5R: as C126 on sheet PWR_P12V0A_N12V0A; Part Number: CC0805_22UF_16V_10%_X5R; Component Kind: Standard; Component Type: Standard; Pin Count: 2; Value: 22uF; Status: Preferred; Manufacturer Part Number: CC0805_22UF_16V_10%_X5R; Case: 0805; Mounted: Yes; Socket: No; SMD: Yes; Sense: No; Manufacturer1 Example: TDK; Manufacturer1 ComponentHeight: 1.35mm; HelpURL: \\cern.ch\dfs\Applications\Altium\Datasheets\CC0805_X5R_TDK_C.pdf; Author: CERN DEM JLC; CreateDate: 25.10.2012; LatestRevisionDate: 25.10.2012
C110 C136 C144 C148 = CTE3216-18_22UF_10V_10%: Polarised capacitor; Part Description: Solid Tantalum Chip Capacitor; Manufacturer: GENERIC; Manufacturer1 Part Number: TAJA226K010R; Voltage: 10V; Tolerance: ±10%; Part Number: CTE3216-18_22UF_10V_10%; Component Kind: Standard; Component Type: Standard; Pin Count: 2; Value: 22uF; Status: Preferred; Manufacturer Part Number: CTE3216-18_22UF_10V_10%; Case: A; Mounted: Yes; Socket: No; SMD: Yes; Sense: No; Manufacturer1 Example: AVX; Manufacturer1 ComponentHeight: 1.8mm; HelpURL: \\cern.ch\dfs\Applications\Altium\Datasheets\CTE_AVX_TAJ.pdf; Author: CERN DEM JLC; CreateDate: 03/12/2007; LatestRevisionDate: 03/12/2007
C133 C141 C145 C197 = CC0603_4.7UF_16V_10%_X5R: Non-polarised capacitor; Part Description: SMD Multilayer Chip Ceramic Capacitor; Manufacturer: GENERIC; Manufacturer1 Part Number: EMK107ABJ475KA-T; Voltage: 16V; TC: X5R; Tolerance: ±10%; Part Number: CC0603_4.7UF_16V_10%_X5R; Component Kind: Standard; Component Type: Standard; Pin Count: 2; Value: 4.7uF; Status: None; Manufacturer Part Number: CC0603_4.7UF_16V_10%_X5R; Case: 0603; Mounted: Yes; Socket: No; SMD: Yes; Sense: No; Manufacturer1 Example: TAIYO YUDEN; Manufacturer1 ComponentHeight: 0.95mm; HelpURL: \\cern.ch\dfs\Applications\Altium\Datasheets\CC0603_X7R_TAIYO-YUDEN_HIGH-VALUE.pdf; Author: CERN DEM JLC; CreateDate: 16-Dec-13; LatestRevisionDate: 16-Sep-14
D24 D27 = PMEG6020ER: as D28 on sheet PWR_P12V0A_N12V0A; Part Number: PMEG6020ER; Component Kind: Standard; Component Type: Standard; Device: PMEG6020ER; PackageDescription: SODFL Diode (SOD123W); 2.60mm W X 1.70mm L X 1.10mm H body, IPC Medium Density; Manufacturer Part Number: PMEG6020ER; Pin Count: 2; Case: SOD-123FL; Mounted: Yes; Socket: No; SMD: Yes; Sense: No; ComponentHeight: 1.1mm; HelpURL: \\cern.ch\dfs\Applications\Altium\Datasheets\PMEG6020ER.pdf; Author: CERN DEM JMW; CreateDate: 19.06.2014; LatestRevisionDate: 19.06.2014
IC8 IC17 = LT1964ES5-SD#TRMPBF: as IC23 on sheet PWR_P12V0A_N12V0A; Part Number: LT1964ES5-SD#TRMPBF; Component Kind: Standard; Component Type: Standard; Device: LT1964ES5-SD#TRMPBF; PackageDescription: SOT23, 0.95mm pitch; 5 pin, 1.75mm W X 3.00mm L, IPC Medium Density; Manufacturer Part Number: LT1964ES5-SD#TRMPBF; Pin Count: 5; Case: SOT23-5; Mounted: Yes; Socket: No; SMD: Yes; Sense: No; ComponentHeight: 1mm; HelpURL: \\cern.ch\dfs\Applications\Altium\Datasheets\LT1964ES5-SD#TRMPBF.pdf; Author: CERN DEM JLC; CreateDate: 05.05.2009; LatestRevisionDate: 05.05.2009
IC9 IC19 = LT3042EMSE#PBF: as IC21 on sheet PWR_P12V0A_N12V0A; Part Number: LT3042EMSE#PBF; Component Kind: Standard; Component Type: Standard; Device: LT3042EMSE#PBF; PackageDescription: SOP, 0.50mm, Pitch; 10 pin, 3.00mm W X 3.00mm L X 1.10mm H body (w/thermal tab  1.68 X 1.98 mm), IPC Medium Density; Part Description: 20V, 200mA, Ultralow Noise, Ultrahigh PSRR RF Linear Regulator; Manufacturer Part Number: LT3042EMSE#PBF; Pin Count: 11; Case: MSOP10; Mounted: Yes; Socket: No; SMD: Yes; Sense: No; ComponentHeight: 1.1mm; HelpURL: \\cern.ch\dfs\Applications\Altium\Datasheets\LT3042EMSE#PBF.pdf; Author: CERN DEM MR; CreateDate: 09.06.2016; LatestRevisionDate: 09.06.2016
IC16 IC18 = LT3045EDD#PBF: 20V, 500mA, Ultralow Noise, Ultrahigh PSRR Linear Regulator; Manufacturer: LINEAR TECHNOLOGY; PressFit: No; Bonding: No; Part Number: LT3045EDD#PBF; Component Kind: Standard; Component Type: Standard; Device: LT3045EDD#PBF; PackageDescription: SON, 0.50mm Pitch; 10 Pin, 3.00mm W X 3.00mm L X 0.80mm H body (w/Thermal Tab 1.75 X 2.48 mm), IPC Medium Density; Part Description: 20V, 500mA, Ultralow Noise, Ultrahigh PSRR Linear Regulator; Manufacturer Part Number: LT3045EDD#PBF; Pin Count: 11; Case: SON10; Mounted: Yes; Socket: No; SMD: Yes; Sense: No; ComponentHeight: 0.8mm; HelpURL: \\cern.ch\dfs\Applications\Altium\Datasheets\LT3045EDD#PBF.pdf; Author: CERN DEM JLC; CreateDate: 07/12/2016; LatestRevisionDate: 07/12/2016
L17-L22 = IND0603_TDK_MPZ1608S331ATD25: Part Description: SMT Chip Bead for Power Line (For Automotive Grade); Manufacturer: TDK; Power: 1.7A; Resistance: 0.08R; Tolerance: ±25%; Part Number: IND0603_TDK_MPZ1608S331ATD25; Component Kind: Standard; Component Type: Standard; Pin Count: 2; Value: 330R@100MHz; Manufacturer Part Number: MPZ1608S331ATD25; Case: 0603; Mounted: Yes; Socket: No; SMD: Yes; Sense: No; ComponentHeight: 0.8mm; HelpURL: \\cern.ch\dfs\Applications\Altium\Datasheets\IND0603_TDK_MPZ1608_Automotive.pdf; Author: CERN DEM JLC; CreateDate: 10.01.2018; LatestRevisionDate: 25.10.2018
R125 R165 = R0402_10K_1%_0.0625W_100PPM: Resistor - 1%; Part Description: General Purpose Thick Film Chip Resistor; Manufacturer: GENERIC; Manufacturer1 Part Number: 232270671003L; PressFit: No; TC: ±100ppm/°C; Part Number: R0402_10K_1%_0.0625W_100PPM; Component Kind: Standard; Component Type: Standard; Pin Count: 2; Value: 10k; Status: Not Recommended; Manufacturer Part Number: R0402_10K_1%_0.0625W_100PPM; Case: 0402; Mounted: Yes; Sense: No; Socket: No; SMD: Yes; Manufacturer1 Example: YAGEO PHYCOMP; Manufacturer1 ComponentHeight: 0.4mm; HelpURL: \\cern.ch\dfs\Applications\Altium\Datasheets\R0402_Phycomp_RC0402.pdf; Author: CERN DEM JLC; CreateDate: 03-Dec-07; LatestRevisionDate: 17-Oct-12; Power: 0.0625W; Tolerance: ±1%
R126 = R0402_39K_1%_0.0625W_100PPM: Resistor - 1%; Part Description: General Purpose Thick Film Chip Resistor; Manufacturer: GENERIC; Manufacturer1 Part Number: 232270673903; TC: ±100ppm/°C; PressFit: No; Part Number: R0402_39K_1%_0.0625W_100PPM; Component Kind: Standard; Component Type: Standard; Pin Count: 2; Value: 39k; Status: Not Recommended; Power: 0.0625W; Manufacturer Part Number: R0402_39K_1%_0.0625W_100PPM; Case: 0402; Mounted: Yes; Sense: No; Socket: No; SMD: Yes; Manufacturer1 Example: YAGEO PHYCOMP; Manufacturer1 ComponentHeight: 0.4mm; HelpURL: \\cern.ch\dfs\Applications\Altium\Datasheets\R0402_Phycomp_RC0402.pdf; Author: CERN DEM JLC; CreateDate: 03.12.2007; LatestRevisionDate: 17.10.2012
R127 = R0402_36K_1%_0.0625W_100PPM: as R179 on sheet PWR_P12V0A_N12V0A; Part Number: R0402_36K_1%_0.0625W_100PPM; Component Kind: Standard; Component Type: Standard; Pin Count: 2; Value: 36k; Status: Not Recommended; Power: 0.0625W; Manufacturer Part Number: R0402_36K_1%_0.0625W_100PPM; Case: 0402; Mounted: Yes; Sense: No; Socket: No; SMD: Yes; Manufacturer1 Example: YAGEO PHYCOMP; Manufacturer1 ComponentHeight: 0.4mm; HelpURL: \\cern.ch\dfs\Applications\Altium\Datasheets\R0402_Phycomp_RC0402.pdf; Author: CERN DEM JLC; CreateDate: 03.12.2007; LatestRevisionDate: 17.10.2012
R134 R191 R220 = R0603_24K9_0.1%_0.063W_10PPM: Resistor - 0.1%; Part Description: Thin Film Chip Resistor; Manufacturer: GENERIC; Manufacturer1 Part Number: RN73C1J24K9BTDF; Power: 0.063W; TC: ±10ppm; PressFit: No; Part Number: R0603_24K9_0.1%_0.063W_10PPM; Component Kind: Standard; Component Type: Standard; Pin Count: 2; Value: 24k9; Status: Not Recommended; Tolerance: ±0.1%; Manufacturer Part Number: R0603_24K9_0.1%_0.063W_10PPM; Case: 0603; Mounted: Yes; Sense: No; Socket: No; SMD: Yes; Manufacturer1 Example: TYCO HOLSWORTHY; Manufacturer1 ComponentHeight: 0.5mm; HelpURL: \\cern.ch\dfs\Applications\Altium\Datasheets\R0603_Tyco_RN73.pdf; Author: CERN DEM JLC
  R134 R220: CreateDate: 03-Dec-07; LatestRevisionDate: 13-Mar-08
  R191: CreateDate: 03.12.2007; LatestRevisionDate: 13.03.2008
R164 = R0603_18K_1%_0.1W_100PPM: Resistor - 1%; Part Description: General Purpose Thick Film Chip Resistor; Manufacturer: GENERIC; Manufacturer1 Part Number: NRC06F1802TRF; Power: 0.1W; TC: ±100ppm/°C; PressFit: No; Part Number: R0603_18K_1%_0.1W_100PPM; Component Kind: Standard; Component Type: Standard; Pin Count: 2; Value: 18k; Status: Preferred; Tolerance: ±1%; Manufacturer Part Number: R0603_18K_1%_0.1W_100PPM; Case: 0603; Mounted: Yes; Sense: No; Socket: No; SMD: Yes; Manufacturer1 Example: NIC COMPONENT; Manufacturer1 ComponentHeight: 0.55mm; HelpURL: \\cern.ch\dfs\Applications\Altium\Datasheets\R0603_NIC_NRC.pdf; Author: CERN DEM JLC; CreateDate: 03/12/2007; LatestRevisionDate: 13/03/2008
R166 = R0402_62K_1%_0.0625W_100PPM: Resistor - 1%; Part Description: General Purpose Thick Film Chip Resistor; Manufacturer: GENERIC; Manufacturer1 Part Number: 232270676203L; TC: ±100ppm/°C; PressFit: No; Part Number: R0402_62K_1%_0.0625W_100PPM; Component Kind: Standard; Component Type: Standard; Pin Count: 2; Value: 62k; Status: Not Recommended; Power: 0.0625W; Manufacturer Part Number: R0402_62K_1%_0.0625W_100PPM; Case: 0402; Mounted: Yes; Sense: No; Socket: No; SMD: Yes; Manufacturer1 Example: YAGEO PHYCOMP; Manufacturer1 ComponentHeight: 0.4mm; HelpURL: \\cern.ch\dfs\Applications\Altium\Datasheets\R0402_Phycomp_RC0402.pdf; Author: CERN DEM JLC; CreateDate: 03.12.2007; LatestRevisionDate: 17.10.2012
R167 R213 R216 = R0402_20K_1%_0.0625W_100PPM: as R148 on sheet PWR_P12V0A_N12V0A; Part Number: R0402_20K_1%_0.0625W_100PPM; Component Kind: Standard; Component Type: Standard; Pin Count: 2; Value: 20k; Status: Not Recommended; Power: 0.0625W; Manufacturer Part Number: R0402_20K_1%_0.0625W_100PPM; Case: 0402; Mounted: Yes; Sense: No; Socket: No; SMD: Yes; Manufacturer1 Example: YAGEO PHYCOMP; Manufacturer1 ComponentHeight: 0.4mm; HelpURL: \\cern.ch\dfs\Applications\Altium\Datasheets\R0402_Phycomp_RC0402.pdf; Author: CERN DEM JLC; CreateDate: 03.12.2007; LatestRevisionDate: 17.10.2012
R169 = R0603_33K2_0.1%_0.063W_10PPM: as R154 on sheet PWR_P12V0A_N12V0A; Part Number: R0603_33K2_0.1%_0.063W_10PPM; Component Kind: Standard; Component Type: Standard; Pin Count: 2; Value: 33k2; Status: Not Recommended; Manufacturer Part Number: R0603_33K2_0.1%_0.063W_10PPM; Case: 0603; Mounted: Yes; Sense: No; Socket: No; SMD: Yes; Manufacturer1 Example: TYCO HOLSWORTHY; Manufacturer1 ComponentHeight: 0.5mm; HelpURL: \\cern.ch\dfs\Applications\Altium\Datasheets\R0603_Tyco_RN73.pdf; Author: CERN DEM JLC; CreateDate: 03.12.2007; LatestRevisionDate: 13.03.2008
R171 = R0603_24K9_0.1%_0.063W_10PPM: Resistor - 0.1%; Part Description: Thin Film Chip Resistor; Manufacturer: GENERIC; Manufacturer1 Part Number: RN73C1J24K9BTDF; PressFit: No; Power: 0.063W; TC: ±10ppm; Part Number: R0603_24K9_0.1%_0.063W_10PPM; Component Kind: Standard; Component Type: Standard; Pin Count: 2; Value: 24k9; Status: Not Recommended; Manufacturer Part Number: R0603_24K9_0.1%_0.063W_10PPM; Case: 0603; Mounted: Yes; Sense: No; Socket: No; SMD: Yes; Manufacturer1 Example: TYCO HOLSWORTHY; Manufacturer1 ComponentHeight: 0.5mm; HelpURL: \\cern.ch\dfs\Applications\Altium\Datasheets\R0603_Tyco_RN73.pdf; Author: CERN DEM JLC; CreateDate: 03.12.2007; LatestRevisionDate: 13.03.2008; Tolerance: ±0.1%
R212 R215 R217 = R0402_2K4_1%_0.0625W_100PPM: as R223 on sheet PWR_P12V0A_N12V0A; Part Number: R0402_2K4_1%_0.0625W_100PPM; Component Kind: Standard; Component Type: Standard; Pin Count: 2; Value: 2k4; Status: Not Recommended; Power: 0.0625W; Tolerance: ±1%; Manufacturer Part Number: R0402_2K4_1%_0.0625W_100PPM; Case: 0402; Mounted: Yes; Sense: No; Socket: No; SMD: Yes; Manufacturer1 Example: YAGEO PHYCOMP; Manufacturer1 ComponentHeight: 0.4mm; HelpURL: \\cern.ch\dfs\Applications\Altium\Datasheets\R0402_Phycomp_RC0402.pdf; Author: CERN DEM JLC; CreateDate: 03.12.2007; LatestRevisionDate: 17.10.2012
R214 R218 = R0402_10K_1%_0.0625W_100PPM: as R152 on sheet PWR_P12V0A_N12V0A; Part Number: R0402_10K_1%_0.0625W_100PPM; Component Kind: Standard; Component Type: Standard; Pin Count: 2; Value: 10k; Status: Not Recommended; Power: 0.0625W; Tolerance: ±1%; Manufacturer Part Number: R0402_10K_1%_0.0625W_100PPM; Case: 0402; Mounted: Yes; Sense: No; Socket: No; SMD: Yes; Manufacturer1 Example: YAGEO PHYCOMP; Manufacturer1 ComponentHeight: 0.4mm; HelpURL: \\cern.ch\dfs\Applications\Altium\Datasheets\R0402_Phycomp_RC0402.pdf; Author: CERN DEM JLC; CreateDate: 03.12.2007; LatestRevisionDate: 17.10.2012
R219 = R0402_4K7_1%_0.0625W_100PPM: Resistor - 1%; Part Description: General Purpose Thick Film Chip Resistor; Manufacturer: GENERIC; Manufacturer1 Part Number: 232270674702L; TC: ±100ppm/°C; PressFit: No; Part Number: R0402_4K7_1%_0.0625W_100PPM; Component Kind: Standard; Component Type: Standard; Pin Count: 2; Value: 4k7; Status: Not Recommended; Power: 0.0625W; Tolerance: ±1%; Manufacturer Part Number: R0402_4K7_1%_0.0625W_100PPM; Case: 0402; Mounted: Yes; Sense: No; Socket: No; SMD: Yes; Manufacturer1 Example: YAGEO PHYCOMP; Manufacturer1 ComponentHeight: 0.4mm; HelpURL: \\cern.ch\dfs\Applications\Altium\Datasheets\R0402_Phycomp_RC0402.pdf; Author: CERN DEM JLC; CreateDate: 03.12.2007; LatestRevisionDate: 17.10.2012

## Sheet SD_CARD.SchDoc: SD Card
size 420 x 297 mm; Date: 2018-12-27; Author: Vitali Tsiukala; DrawnBy: Vitali Tsiukala; Engineer: Vitali Tsiukala; Organization: Trenz Electronic GmbH; DocumentNumber: 13; Revision: 03; SheetNumber: 13; SheetTotal: 37; ModifiedBy: -; CheckedDate: -; Title2: Fast Stabilizer; DivGrp: WUT ISE; Designer: G.Kasprowicz
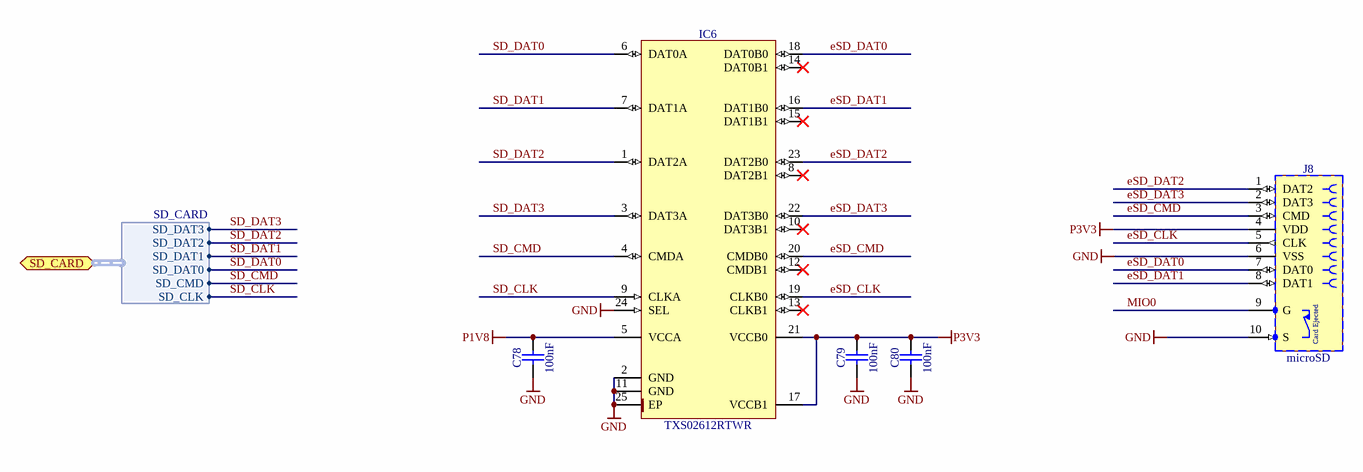
[diagram p23: SD_CARD.SchDoc]

### Parts
C78  100nF  [CAPC1005X55N]
C79  100nF  [CAPC1005X55N]
C80  100nF  [CAPC1005X55N]
IC6  TXS02612RTWR  [QFN50P400X400X80-25N-S255]
J8  microSD  [ATTEND_112A-TAAR-R03]

### Ports
SD_CARD (bidir, harness SD_CARD)

### Harnesses
SD_CARD: SD_DAT3, SD_DAT2, SD_DAT1, SD_DAT0, SD_CMD, SD_CLK

### Nets
GND: C78.1 C79.1 C80.1 IC6.2(GND) IC6.11(GND) IC6.24(SEL) IC6.25(EP) J8.6(VSS) J8.10(S)
P1V8: C78.2 IC6.5(VCCA)
P3V3: C79.2 C80.2 IC6.17(VCCB1) IC6.21(VCCB0) J8.4(VDD)
eSD_CLK: IC6.19(CLKB0) J8.5(CLK)
eSD_CMD: IC6.20(CMDB0) J8.3(CMD)
eSD_DAT0: IC6.18(DAT0B0) J8.7(DAT0)
eSD_DAT1: IC6.16(DAT1B0) J8.8(DAT1)
eSD_DAT2: IC6.23(DAT2B0) J8.1(DAT2)
eSD_DAT3: IC6.22(DAT3B0) J8.2(DAT3)
MIO0: J8.9(G)
SD_CLK: IC6.9(CLKA) ; port SD_CARD.SD_CLK
SD_CMD: IC6.4(CMDA) ; port SD_CARD.SD_CMD
SD_DAT0: IC6.6(DAT0A) ; port SD_CARD.SD_DAT0
SD_DAT1: IC6.7(DAT1A) ; port SD_CARD.SD_DAT1
SD_DAT2: IC6.1(DAT2A) ; port SD_CARD.SD_DAT2
SD_DAT3: IC6.3(DAT3A) ; port SD_CARD.SD_DAT3

Not connected (* = marked no-connect by the designer): IC6 8(DAT2B1)* 10(DAT3B1)* 12(CMDB1)* 13(CLKB1)* 14(DAT0B1)* 15(DAT1B1)*

### Notes on the sheet
- Project/Equipment
- Document
- Designer
- Drawn by
- Check.by
- Copyright WUT ISE 2020.
  This documentation describes Open Hardware and is licensed under the CERN OHL v.1.2. You may redistribute and modify this documentation under the terms of the CERN OHL v.1.2. (http://ohwr.org/CERNOHL). This documentation is distributed WITHOUT ANY EXPRESS OR IMPLIED WARRANTY, INCLUDING OF MERCHANTABILITY, SATISFACTORY QUALITY AND FITNESS FOR A PARTICULAR PURPOSE. Please see the CERN OHL v.1.2 for applicable conditions.
- Contact
- File
- Last Mod.
- Print Date
- Sheet
- Size
- A3
- of
- Rev
- (in symbol ATTEND_112A-TAAR-R03) Card Ejected

### Library data of the parts
C78-C80 = CC0402_100NF_16V_10%_X5R: Non-polarised capacitor; Part Description: SMD Multilayer Chip Ceramic Capacitor; Manufacturer: GENERIC; Manufacturer1 Part Number: GRM155R61C104KA88D; Voltage: 16V; TC: X5R; Tolerance: ±10%; Part Number: CC0402_100NF_16V_10%_X5R; Component Kind: Standard; Component Type: Standard; Pin Count: 2; Value: 100nF; Status: None; Manufacturer Part Number: CC0402_100NF_16V_10%_X5R; Case: 0402; Mounted: Yes; Socket: No; SMD: Yes; Sense: No; Manufacturer1 Example: MURATA; Manufacturer1 ComponentHeight: 0.55mm; HelpURL: \\cern.ch\dfs\Applications\Altium\Datasheets\CC0402_X5R_MURATA_GRM.pdf; Author: CERN DEM JLC; CreateDate: 10.12.2013; LatestRevisionDate: 10.12.2013
IC6 = TXS02612RTWR: SDIO Port Expander With Voltage-Level Translation; Manufacturer: TEXAS INSTRUMENTS; PressFit: No; Bonding: No; Part Number: TXS02612RTWR; Component Kind: Standard; Component Type: Standard; Device: TXS02612RTWR; PackageDescription: QFN, 0.50mm Pitch, Square; 6 Pin X 6 Pin, 4mm X 4mm Body (w/Thermal Tab 2.55 X 2.55 mm), IPC Medium Density; Part Description: SDIO Port Expander With Voltage-Level Translation; Manufacturer Part Number: TXS02612RTWR; Pin Count: 25; Case: QFN24; Mounted: Yes; Socket: No; SMD: Yes; Sense: No; ComponentHeight: 0.8mm; Author: CERN DEM JLC; HelpURL: \\cern.ch\dfs\Applications\Altium\Datasheets\TXS02612RTWR.pdf; CreateDate: 19-Nov-14; LatestRevisionDate: 19-Nov-14
J8 = ATTEND_112A-TAAR-R03: Connector MicroSD 8 Pin + Switch; Part Description: MicroSD Socket, Push-Push Type; Manufacturer: ATTEND; PressFit: No; Part Number: ATTEND_112A-TAAR-R03; Component Kind: Standard; Component Type: Standard; Pin Count: 10; Family: microSD; Mounted: Yes; Socket: No; SMD: Yes; Sense: No; Status: None; Manufacturer Part Number: 112A-TAAR-R03; ComponentHeight: 1.9mm; HelpURL: \\cern.ch\dfs\Applications\Altium\Datasheets\ATTEND_112A-TAAR-R03.pdf; Author: CERN DEM JMW; CreateDate: 07-Jul-15; LatestRevisionDate: 07-Jul-15